# EAGLE design ADC_PWM_Board (EAGLE 7.7.0)
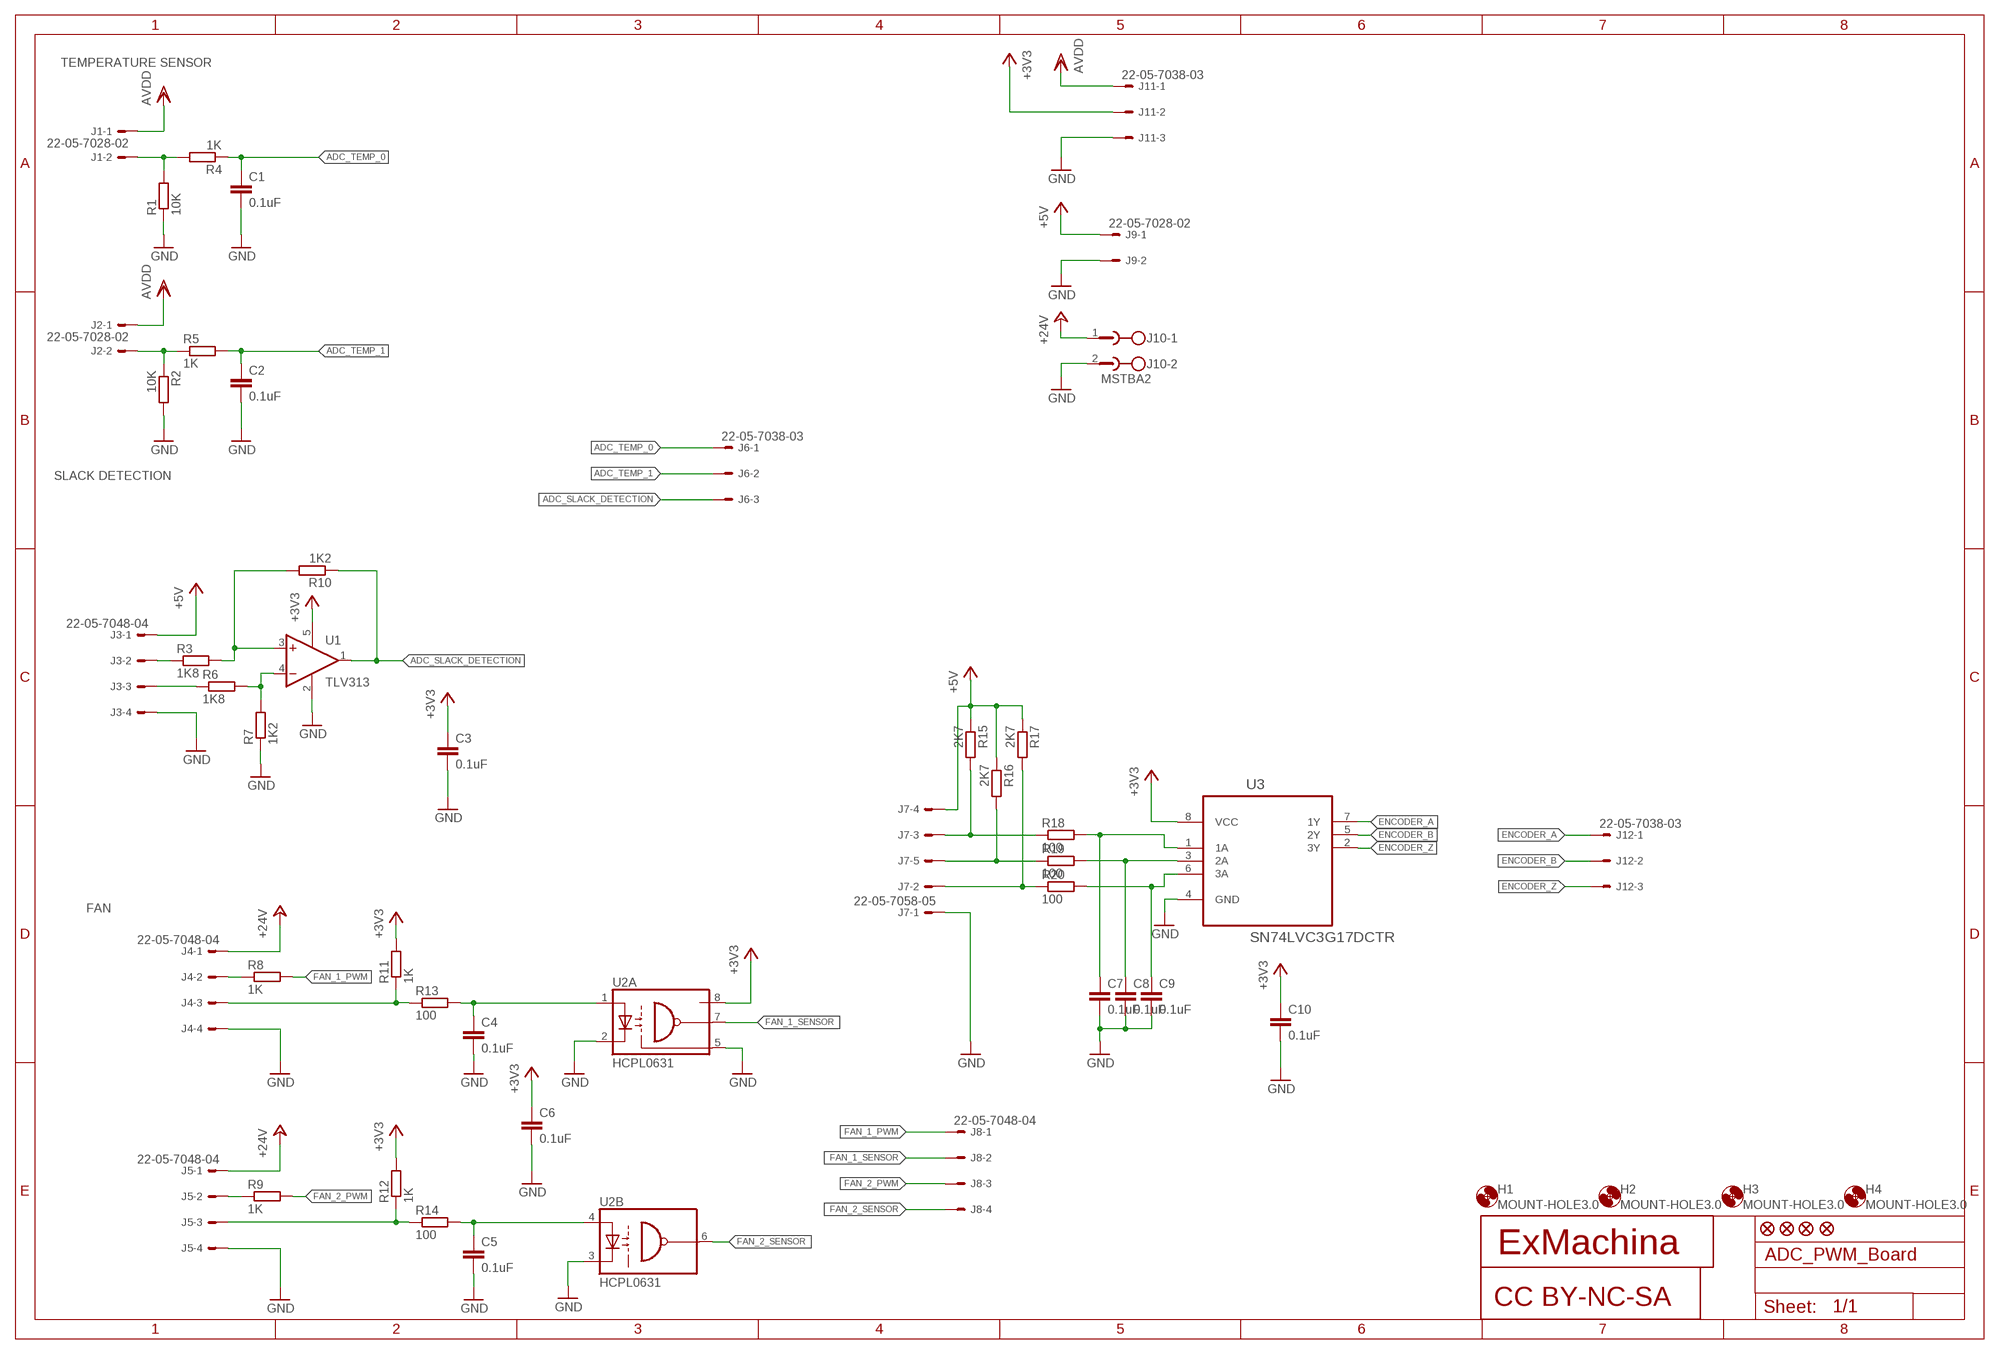
[diagram p0: schematic, sheet 1]

## Parts
C1  0.1uF  C-EUC0603  [C0603]
C2  0.1uF  C-EUC0603  [C0603]
C3  0.1uF  C-EUC0603  [C0603]
C4  0.1uF  C-EUC0603  [C0603]
C5  0.1uF  C-EUC0603  [C0603]
C6  0.1uF  C-EUC0603  [C0603]
C7  0.1uF  C-EUC0603  [C0603]
C8  0.1uF  C-EUC0603  [C0603]
C9  0.1uF  C-EUC0603  [C0603]
C10  0.1uF  C-EUC0603  [C0603]
CC1  CC-BY-NC-SA  [CC-BY-NC-SA]
H1  MOUNT-HOLE3.0  [3,0]
H2  MOUNT-HOLE3.0  [3,0]
H3  MOUNT-HOLE3.0  [3,0]
H4  MOUNT-HOLE3.0  [3,0]
J1  22-05-7028-02  [7395-02]
J2  22-05-7028-02  [7395-02]
J3  22-05-7048-04  [7395-04]
J4  22-05-7048-04  [7395-04]
J5  22-05-7048-04  [7395-04]
J6  22-05-7038-03  [7395-03]
J7  22-05-7058-05  [7395-05]
J8  22-05-7048-04  [7395-04]
J9  22-05-7028-02  [7395-02]
J10  MSTBA2  [MSTBA2]
J11  22-05-7038-03  [7395-03]
J12  22-05-7038-03  [7395-03]
JP1  FIDUCIAL1X2  [FIDUCIAL-1X2]
JP2  FIDUCIAL1X2  [FIDUCIAL-1X2]
JP3  FIDUCIAL1X2  [FIDUCIAL-1X2]
JP4  FIDUCIAL1X2  [FIDUCIAL-1X2]
R1  10K  R-EU_R0603  [R0603]
R2  10K  R-EU_R0603  [R0603]
R3  1K8  R-EU_R0603  [R0603]
R4  1K  R-EU_R0603  [R0603]
R5  1K  R-EU_R0603  [R0603]
R6  1K8  R-EU_R0603  [R0603]
R7  1K2  R-EU_R0603  [R0603]
R8  1K  R-EU_R0603  [R0603]
R9  1K  R-EU_R0603  [R0603]
R10  1K2  R-EU_R0603  [R0603]
R11  1K  R-EU_R0603  [R0603]
R12  1K  R-EU_R0603  [R0603]
R13  100  R-EU_R0603  [R0603]
R14  100  R-EU_R0603  [R0603]
R15  2K7  R-EU_R0603  [R0603]
R16  2K7  R-EU_R0603  [R0603]
R17  2K7  R-EU_R0603  [R0603]
R18  100  R-EU_R0603  [R0603]
R19  100  R-EU_R0603  [R0603]
R20  100  R-EU_R0603  [R0603]
T1  EXMACHINA-LOGO-NAME  [EXM-LOGO-BASELINE]
U1  TLV313  [SOT23-DBV]
U2  HCPL0631  [SOIC08]
U3  SN74LVC3G17DCTR  [SOP65P400X130-8N]

## Nets
+3V3 [supply]: C3.1 C6.1 C10.1 J11.2 R11.2 R12.2 U1.5(V+) U2.8(A:VCC) U3.8(VCC)
+5V [supply]: J3.1 J7.4 J9.1 R15.1 R16.1 R17.1
+24V: J4.1 J5.1 J10.1
ADC_SLACK_DETECTION [signal]: J6.3 R10.1 U1.1(OUT)
ADC_TEMP_0 [signal]: C1.1 J6.1 R4.1
ADC_TEMP_1 [signal]: C2.1 J6.2 R5.2
AVDD: J1.1 J2.1 J11.1
ENCODER_A: J12.1 U3.7(1Y)
ENCODER_B: J12.2 U3.5(2Y)
ENCODER_Z: J12.3 U3.2(3Y)
FAN_1_PWM [signal]: J8.1 R8.2
FAN_1_SENSOR [signal]: J8.2 U2.7(A:VO)
FAN_2_PWM [signal]: J8.3 R9.2
FAN_2_SENSOR [signal]: J8.4 U2.6(B:VO2)
GND [supply]: C1.2 C2.2 C3.2 C4.2 C5.2 C6.2 C7.2 C8.2 C9.2 C10.2 J3.4 J4.4 J5.4 J7.1 J9.2 J10.2 J11.3 R1.1 R2.2 R7.1 U1.2(V-) U2.2(A:C1) U2.3(B:C2) U2.5(A:GND) U3.4(GND)
N$1: J4.3 R11.1 R13.1
N$2: J5.3 R12.1 R14.1
N$3: C4.1 R13.2 U2.1(A:A1)
N$4: C5.1 R14.2 U2.4(B:A2)
N$11 [signal]: J4.2 R8.1
N$13 [signal]: J5.2 R9.1
N$31: J3.2 R3.1
N$35: J7.3 R15.2 R18.1
N$40: J7.5 R16.2 R19.1
N$46: J7.2 R17.2 R20.1
N$52: C9.1 R20.2 U3.6(3A)
N$53: C8.1 R19.2 U3.3(2A)
N$54: C7.1 R18.2 U3.1(1A)
N$61: R3.2 R10.2 U1.3(+IN)
N$65: J1.2 R1.2 R4.2
N$66: J2.2 R2.1 R5.1
N$67: R6.2 R7.2 U1.4(-IN)
N$68: J3.3 R6.1

## Notes on the sheet
- TEMPERATURE SENSOR
- SLACK DETECTION
- FAN

## Library data of the parts
C1-C10 = rcl:C-EU: CAPACITOR, European symbol; MPN: MC0603B104K250CT; OC_NEWARK: 06R4925
CC1 = cc-by-sa:CC-BY-NC-SA; OC_NEWARK: unknown
H1-H4 = holes:MOUNT-HOLE: MOUNTING HOLE with drill center marker; OC_NEWARK: unknown
J1 J2 J9 = con-molex:22-?-02: CONNECTOR wire to board 2.54 mm (.1 inch) pitch header; MPN: 22-05-7028; OC_FARNELL: 9731601; OC_NEWARK: 25M1728
J3-J5 J8 = con-molex:22-?-04: CONNECTOR wire to board 2.54 mm (.1 inch) pitch header; MPN: 22-05-7048; OC_FARNELL: unknown; OC_NEWARK: 26M6363
J6 J11 J12 = con-molex:22-?-03: CONNECTOR wire to board 2.54 mm (.1 inch) pitch header; MPN: 22-05-7038; OC_FARNELL: 9731610; OC_NEWARK: 26M6362
J7 = con-molex:22-?-05: CONNECTOR wire to board 2.54 mm (.1 inch) pitch header; MF: MOLEX; MPN: 22-05-7058; OC_FARNELL: unknown; OC_NEWARK: 55H9619
J10 = con-phoenix-508:MSTBA2: PHOENIX; MF: FARNELL; MPN: 1757242; OC_FARNELL: 3705171; OC_NEWARK: 71C4161
JP1-JP4 = SparkFun:FIDUCIAL: Fiducial Alignment Points Various fiducial points for machine vision alignment.; OC_NEWARK: unknown
R1 R2 = rcl:R-EU_: RESISTOR, European symbol; MPN: MCMR06X1002FTL; OC_NEWARK: 86T3506
R3 R6 = rcl:R-EU_: RESISTOR, European symbol; MPN: MCMR06X1801FTL; OC_NEWARK: 86T3556
R4 R5 R8 R9 R11 R12 = rcl:R-EU_: RESISTOR, European symbol; MPN: MCMR06X1001FTL; OC_NEWARK: 86T3505
R7 R10 = rcl:R-EU_: RESISTOR, European symbol; MPN: MCMR06X1201FTL; OC_NEWARK: 86T3525
R13 R14 R18-R20 = rcl:R-EU_: RESISTOR, European symbol; MPN: MCMR06X1000FTL; OC_NEWARK: 86T3504
R15-R17 = rcl:R-EU_: RESISTOR, European symbol; MPN: MCMR06X4701FTL; OC_NEWARK: 86T3649
T1 = exmachina:EXMACHINA-LOGO; OC_NEWARK: unknown
U1 = ti:TLV313; MPN: TLV313IDBVT; OC_NEWARK: 95Y0395
U2 = optocoupler:HCPL0631; MPN: HCPL-0631-500E; OC_NEWARK: 52M7944
U3 = ti:SN74LVC3G17DCTR: TRIPLE SCHMITT-TRIGGER BUFFER; MF: TEXAS INSTRUMENTS; MPN: SN74LVC3G17DCTR; OC_FARNELL: 1236391; OC_NEWARK: 90H3713; PACKAGE: SSOP-8; SUPPLIER: Texas Instruments

## Net classes
1 signal: width 0.178 mm, drill 0.35 mm
2 supply: width 0.008 mm, drill 0.5 mm

## Board
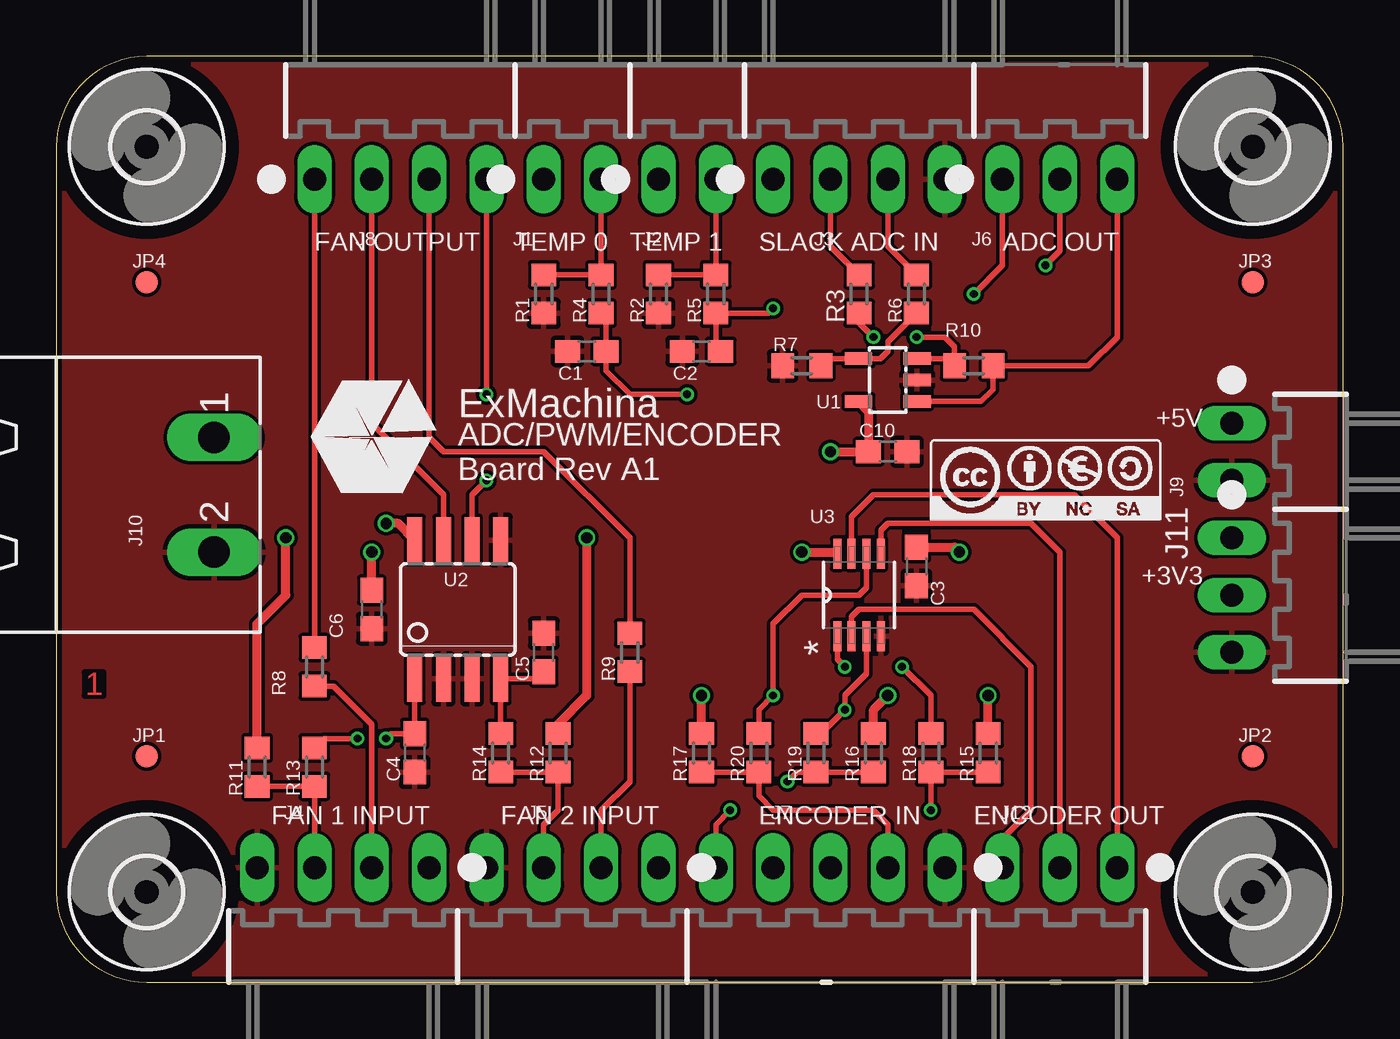
[diagram p1: board, top side]
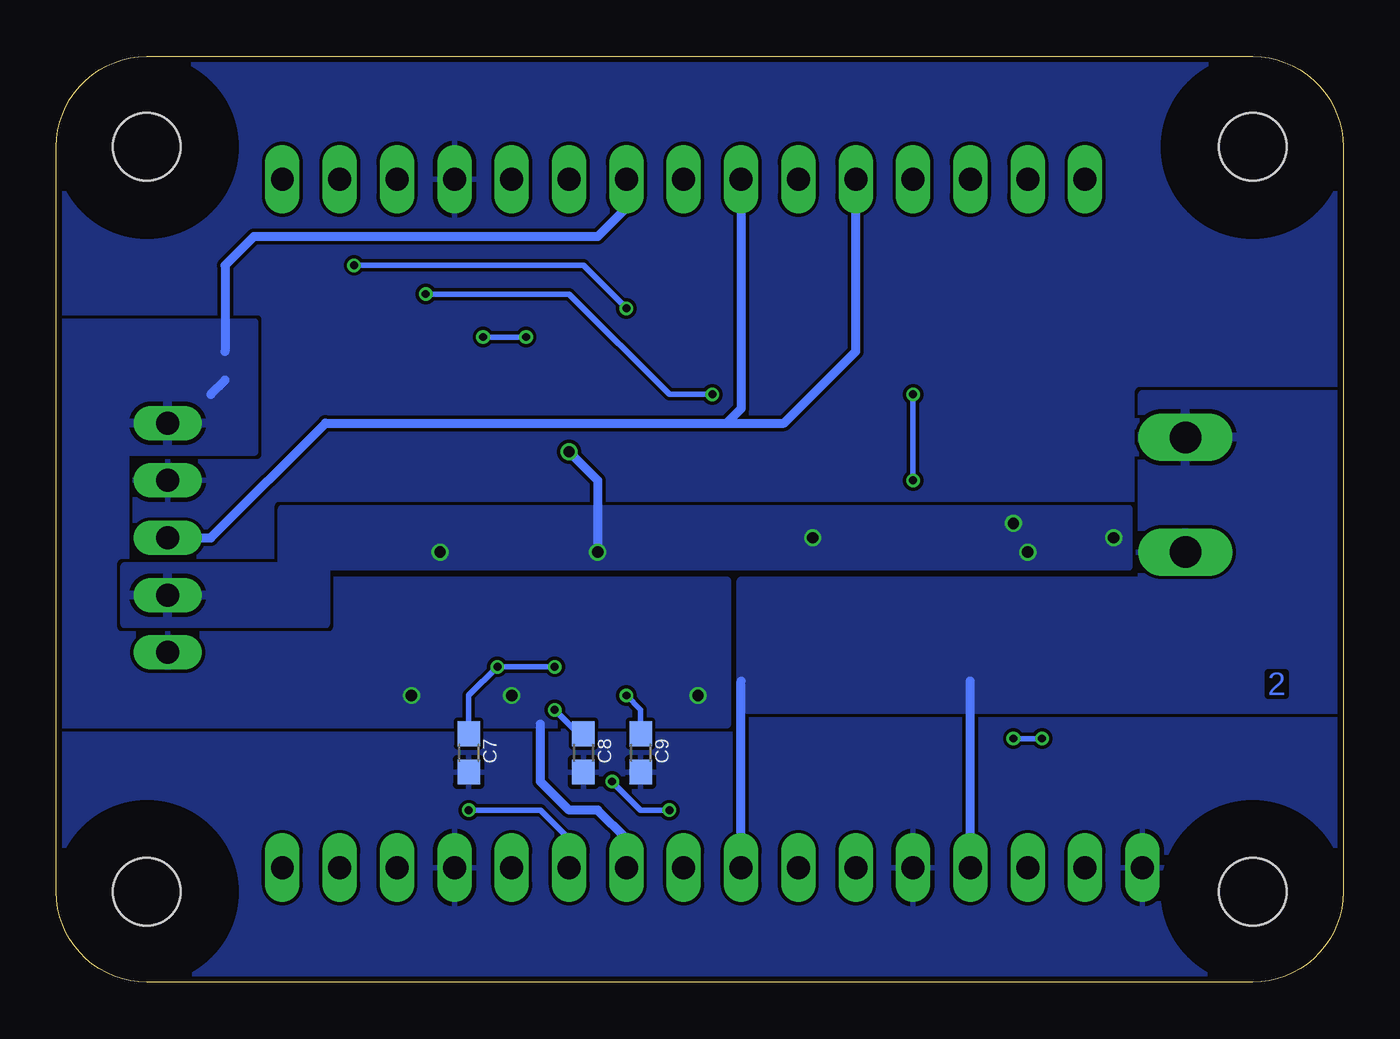
[diagram p2: board, bottom side, seen from below]

Size 57 x 41 mm. Coordinates in mm from the lower left corner, seen from the top.
Outline: 0,37 0,4 arc90 4,0 53,0 arc90 57,4 57,37 arc90 53,41 4,41 arc90 0,37
Copper layers (1*16): Top 0.018mm / dielectric 1.55mm / Bottom 0.018mm
Design rules "eC_2Layer_PClass6_BaseCopperO18_eCDefault *": minimum track width 0.15mm, minimum drill 0.35mm, track to track 0.15mm, track to pad 0.15mm, pad to pad 0.15mm, via to via 0.15mm, smd to smd 0mil, copper to edge 0.25mm, drill to drill 0.35mm, minimum pad ring 0.175mm, minimum via ring 0.125mm, stop-mask expansion 0mil, vias tented up to drill 0.45mm, thermal gap 0.2mm

### Footprints (pad centres in the part's own frame; a part is rotated, then mirrored left to right if it is on the bottom)
C0603 = smd 1.1 x 1: 1 -0.85,0; 2 0.85,0
3,0 = hole 3: 0,0
7395-02 = drill 1.016 long: 1 1.27,0; 2 -1.27,0
7395-04 = drill 1.016 long: 1 3.81,0; 2 1.27,0; 3 -1.27,0; 4 -3.81,0
7395-03 = drill 1.016 long: 1 2.54,0; 2 0,0; 3 -2.54,0
7395-05 = drill 1.016 long: 1 5.08,0; 2 2.54,0; 3 0,0; 4 -2.54,0; 5 -5.08,0
MSTBA2 = drill 1.397 long: 1 -2.54,5.08; 2 2.54,5.08
FIDUCIAL-1X2 = smd 1 x 1: 1 0,0
R0603 = smd 1 x 1.1: 1 -0.85,0; 2 0.85,0
SOT23-DBV = smd 0.55 x 1.2: 1 -0.95,-1.3; 2 0,-1.3; 3 0.95,-1.3; 4 0.95,1.3; 5 -0.95,1.3
SOIC08 = smd 0.66 x 2.032: 1 -1.905,-3.073; 2 -0.635,-3.073; 3 0.635,-3.073; 4 1.905,-3.073; 5 1.905,3.073; 6 0.635,3.073; 7 -0.635,3.073; 8 -1.905,3.073
SOP65P400X130-8N = smd 1.321 x 0.356: 1 -1.829,0.965; 2 -1.829,0.33; 3 -1.829,-0.33; 4 -1.829,-0.965; 5 1.829,-0.965; 6 1.829,-0.33; 7 1.829,0.33; 8 1.829,0.965

### Placement (x,y rotation side)
C1  23.5,27.94 180 top
C2  28.57,27.94 180 top
C3  38.1,18.41 270 top
C4  15.88,10.16 270 top
C5  21.59,14.61 90 top
C6  13.97,16.51 270 top
C7  38.73,10.16 270 bottom
C8  33.66,10.16 270 bottom
C9  31.11,10.16 270 bottom
C10  36.83,23.5 0 top
CC1  43.81,22.23 0 top
H1  4,4 90 top
H2  53,4 90 top
H3  4,37 90 top
H4  53,37 90 top
J1  22.86,35.56 180 top
J2  27.94,35.56 180 top
J3  35.56,35.56 180 top
J4  12.7,5.08 0 top
J5  22.86,5.08 0 top
J6  44.45,35.56 180 top
J7  34.29,5.08 0 top
J8  15.24,35.56 180 top
J9  52.07,23.5 90 top
J10  1.91,21.59 270 top
J11  52.07,17.14 90 top
J12  44.45,5.08 0 top
JP1  4,10 0 top
JP2  53,10 0 top
JP3  53,31 0 top
JP4  4,31 0 top
R1  21.59,30.48 90 top
R2  26.67,30.48 270 top
R3  35.56,30.48 270 top
R4  24.13,30.48 90 top
R5  29.21,30.48 270 top
R6  38.1,30.48 270 top
R7  33.02,27.3 0 top
R8  11.43,13.97 90 top
R9  25.4,14.61 90 top
R10  40.64,27.3 180 top
R11  8.89,9.53 90 top
R12  22.23,10.16 90 top
R13  11.43,9.53 90 top
R14  19.68,10.16 90 top
R15  41.27,10.16 270 top
R16  36.2,10.16 270 top
R17  28.57,10.16 270 top
R18  38.73,10.16 90 top
R19  33.66,10.16 90 top
R20  31.11,10.16 90 top
T1  13.97,24.13 0 top
U1  36.83,26.67 90 top
U2  17.78,16.51 0 top
U3  35.56,17.14 90 top

### Tracks (layer width: path | path; a pad name or v marks a point on that pad's centre or on a via)
+3V3  (via drill 0.5)
  Top 0.406: v33.02,19.05 34.52,19.05 U3.8 | C3.1 39.79,19.27 v40.01,19.05 | v34.29,23.5 C10.1 35.98,25.27 U1.5 | R11.2 8.89,15.88 10.16,17.14 v10.16,19.68 | v23.5,19.68 23.5,12.7 22.23,11.43 R12.2 | C6.1 v13.97,19.05 | U2.8 15.14,20.32 v14.61,20.32
  Bottom 0.406: v34.29,23.5 33.02,22.23 v33.02,19.05
  pour Bottom: 46.99,20.95 9.53,20.95 9.53,18.41 45.09,18.41 45.09,15.88 53.98,15.88 53.98,18.41 46.99,18.41
+5V  (via drill 0.5)
  Top 0.406: R17.1 v28.57,12.7 | R15.1 v41.27,12.7 | R16.1 36.2,12.06 v36.83,12.7
  Bottom 0.406: J3.1 31.75,34.29 33.02,33.02 48.26,33.02 49.53,31.75 49.53,27.94 | 49.53,26.67 50.16,26.04 | J7.4 31.75,6.35 33.02,7.62 34.29,7.62 35.56,8.89 35.56,11.43
  pour Bottom (rank 2): 27.3,17.78 27.3,11.43 59.69,11.43 59.69,29.21 48.26,29.21 48.26,23.5 53.98,23.5 53.98,17.78
+24V
  Bottom 0.406: J4.1 16.51,13.34 | J5.1 26.67,13.34
  pour Bottom: -0.64,26.04 -0.64,12.06 26.67,12.06 26.67,17.78 8.89,17.78 8.89,26.04
ADC_SLACK_DETECTION
  Top 0.254: J6.3 46.99,28.57 45.72,27.3 R10.1 41.49,26.25 40.96,25.72 U1.1
ADC_TEMP_0  (via drill 0.35)
  Top 0.254: R4.1 24.34,29.41 C1.1 24.34,27.09 25.4,26.04 v27.94,26.04 | J6.1 41.91,31.75 v40.64,30.48
  Bottom 0.254: v40.64,30.48 34.29,30.48 29.84,26.04 v27.94,26.04
ADC_TEMP_1  (via drill 0.35)
  Top 0.254: C2.1 29.21,28.16 R5.2 31.54,29.63 v31.75,29.84 | J6.2 44.45,32.38 v43.81,31.75
  Bottom 0.254: v43.81,31.75 33.66,31.75 v31.75,29.84
AVDD
  Bottom 0.406: J11.1 50.16,19.68 45.09,24.77 27.3,24.77 | 27.3,24.77 24.77,24.77 21.59,27.94 J1.1 | J2.1 26.67,25.4 27.3,24.77
ENCODER_A
  Top 0.254: U3.7 35.23,20.62 36.2,21.59 45.09,21.59 46.99,19.68 J12.1
ENCODER_B
  Top 0.254: U3.5 36.52,20.02 36.83,20.32 43.18,20.32 44.45,19.05 J12.2
ENCODER_Z
  Top 0.254: U3.2 35.23,16.18 35.56,16.51 40.64,16.51 43.18,13.97 43.18,7.62 41.91,6.35 J12.3
FAN_1_PWM
  Top 0.254: J8.1 R8.2
FAN_1_SENSOR
  Top 0.254: U2.7 17.14,21.59 13.97,24.77 J8.2
FAN_2_PWM
  Top 0.254: R9.2 25.4,19.68 21.59,23.5 17.14,23.5 16.51,24.13 J8.3
FAN_2_SENSOR  (via drill 0.35)
  Top 0.254: J8.4 v19.05,26.04 | v19.05,22.23 18.41,21.59 U2.6
  Bottom 0.254: v19.05,26.04 v19.05,22.23
GND
  pour Top: -7.62,46.99 64.77,46.99 64.77,-3.81 -7.62,-3.81
  pour Bottom (rank 6): -6.35,45.72 63.5,45.72 63.5,7.62 63.5,-2.54 -6.35,-2.54
N$1
  Top 0.254: J4.3 R13.1 R11.1
N$2
  Top 0.254: R14.1 R12.1 22.23,7.62 21.59,6.99 J5.3
N$3  (via drill 0.35)
  Top 0.254: U2.1 C4.1 14.82,11.01 v14.61,10.79 | v13.34,10.79 11.85,10.79 R13.2
  Bottom 0.254: v14.61,10.79 v13.34,10.79
N$4
  Top 0.254: R14.2 U2.4 21.27,13.44 C5.1
N$11
  Top 0.254: J4.2 13.97,11.43 12.28,13.12 R8.1
N$13
  Top 0.254: J5.2 24.13,7.62 25.4,8.89 R9.1
N$31
  Top 0.254: R3.1 34.29,32.6 J3.2
N$35  (via drill 0.35)
  Top 0.254: R15.2 R18.1 v38.73,7.62
  Bottom 0.254: J7.3 34.29,6.35 35.56,7.62 v38.73,7.62
N$40  (via drill 0.35)
  Top 0.254: R16.2 R19.1 32.8,9.31 v32.38,8.89 | J7.5 29.21,6.99 v29.84,7.62
  Bottom 0.254: v29.84,7.62 31.11,7.62 v32.38,8.89
N$46
  Top 0.254: R17.2 R20.1 31.11,8.26 31.75,7.62 36.2,7.62 36.83,6.99 J7.2
N$52  (via drill 0.35)
  Top 0.254: U3.6 35.89,17.48 35.56,17.14 33.02,17.14 31.75,15.88 v31.75,12.7 31.11,12.06 C9.1
  Bottom 0.254: v31.75,12.7 31.11,12.06 C9.1
N$53  (via drill 0.35)
  Top 0.254: U3.3 35.89,13.66 34.92,12.7 v34.92,12.06 33.87,11.01 C8.1
  Bottom 0.254: C8.1 33.87,11.01 v34.92,12.06
N$54  (via drill 0.35)
  Top 0.254: U3.1 34.59,14.3 v34.92,13.97 | C7.1 38.73,12.7 v37.47,13.97
  Bottom 0.254: v34.92,13.97 v37.47,13.97 38.73,12.7 C7.1 38.73,11.43
N$61  (via drill 0.35)
  Top 0.254: U1.3 39.48,27.62 R10.2 39.79,28.16 39.37,28.57 v38.1,28.57 | R3.2 35.56,29.21 v36.2,28.57
  Bottom 0.254: v36.2,28.57 v38.1,28.57
N$65
  Top 0.254: J1.2 R4.2 R1.2
N$66
  Top 0.254: R2.1 R5.1 J2.2
N$67
  Top 0.254: R7.2 34.19,27.62 U1.4 36.51,27.62 36.83,27.94 36.83,28.36 R6.2
N$68
  Top 0.254: R6.1 36.83,32.6 J3.3

### Text on the board
Top: 1
Bottom: 2
tPlace: FAN OUTPUT | TEMP 0 | TEMP 1 | SLACK ADC IN | ADC OUT | +5V | ADC/PWM/ENCODER / Board Rev A1 | +3V3 | FAN 1 INPUT | FAN 2 INPUT | ENCODER IN | ENCODER OUT